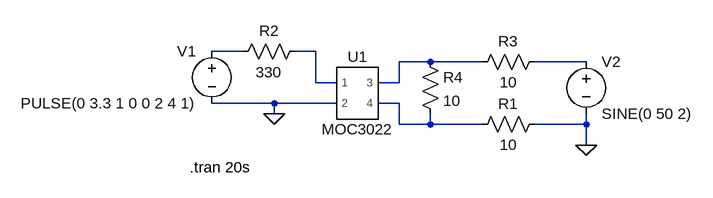
[diagram p0: schematic MOSC3022 test.asc]
MOSC3022 test.asc, the LTspice schematic file:
Version 4
SHEET 1 968 680
WIRE 16 64 -32 64
WIRE 128 64 96 64
WIRE 304 80 256 80
WIRE 384 80 304 80
WIRE 544 80 464 80
WIRE 128 112 128 64
WIRE 160 112 128 112
WIRE 256 112 256 80
WIRE 256 112 224 112
WIRE 64 144 -32 144
WIRE 160 144 64 144
WIRE 256 144 224 144
WIRE 64 160 64 144
WIRE 256 176 256 144
WIRE 304 176 304 160
WIRE 304 176 256 176
WIRE 384 176 304 176
WIRE 544 176 544 160
WIRE 544 176 464 176
WIRE 544 208 544 176
FLAG 64 160 0
FLAG 544 208 0
SYMBOL AutoGenerated\\MOC3022 192 128 R0
SYMATTR InstName U1
SYMBOL res 480 160 R90
WINDOW 0 0 56 VBottom 2
WINDOW 3 32 56 VTop 2
SYMATTR InstName R1
SYMATTR Value 10
SYMBOL res 112 48 R90
WINDOW 0 0 56 VBottom 2
WINDOW 3 32 56 VTop 2
SYMATTR InstName R2
SYMATTR Value 330
SYMBOL res 480 64 R90
WINDOW 0 0 56 VBottom 2
WINDOW 3 32 56 VTop 2
SYMATTR InstName R3
SYMATTR Value 10
SYMBOL voltage -32 48 M0
WINDOW 123 0 0 Left 0
WINDOW 39 0 0 Left 0
SYMATTR InstName V1
SYMATTR Value PULSE(0 3.3 1 0 0 2 4 1)
SYMBOL res 288 64 R0
SYMATTR InstName R4
SYMATTR Value 10
SYMBOL voltage 544 64 R0
WINDOW 123 0 0 Left 0
WINDOW 39 0 0 Left 0
SYMATTR InstName V2
SYMATTR Value SINE(0 50 2)
TEXT -66 242 Left 2 !.tran 20s

The netlist it stands for:
* MOSC3022 test.asc
XU1 N002 0 N003 N005 MOC3022  ; pins 1 2 3 4
R1 0 N005 10
R2 N002 N001 330
R3 N004 N003 10
V1 N001 0 PULSE(0 3.3 1 0 0 2 4 1)
R4 N003 N005 10
V2 N004 0 SINE(0 50 2)
.tran 20s
.lib Z:\media\Daten\Projekte\ELController\ltspice model\MOC3022.lib
.backanno
.end